# Altium project UZ_A_LTC2311.PrjPCB (part 2 of 2)

## Sheet Power_Neg.SchDoc
size A4; CompanyName: Technische Hochschule Nürnberg Georg Simon Ohm; Organization: UltraZohm; Address1: Kesslerplatz 12; Address2: 90489 Nürnberg; Address3: GERMANY; Website: www.ultrazohm.com
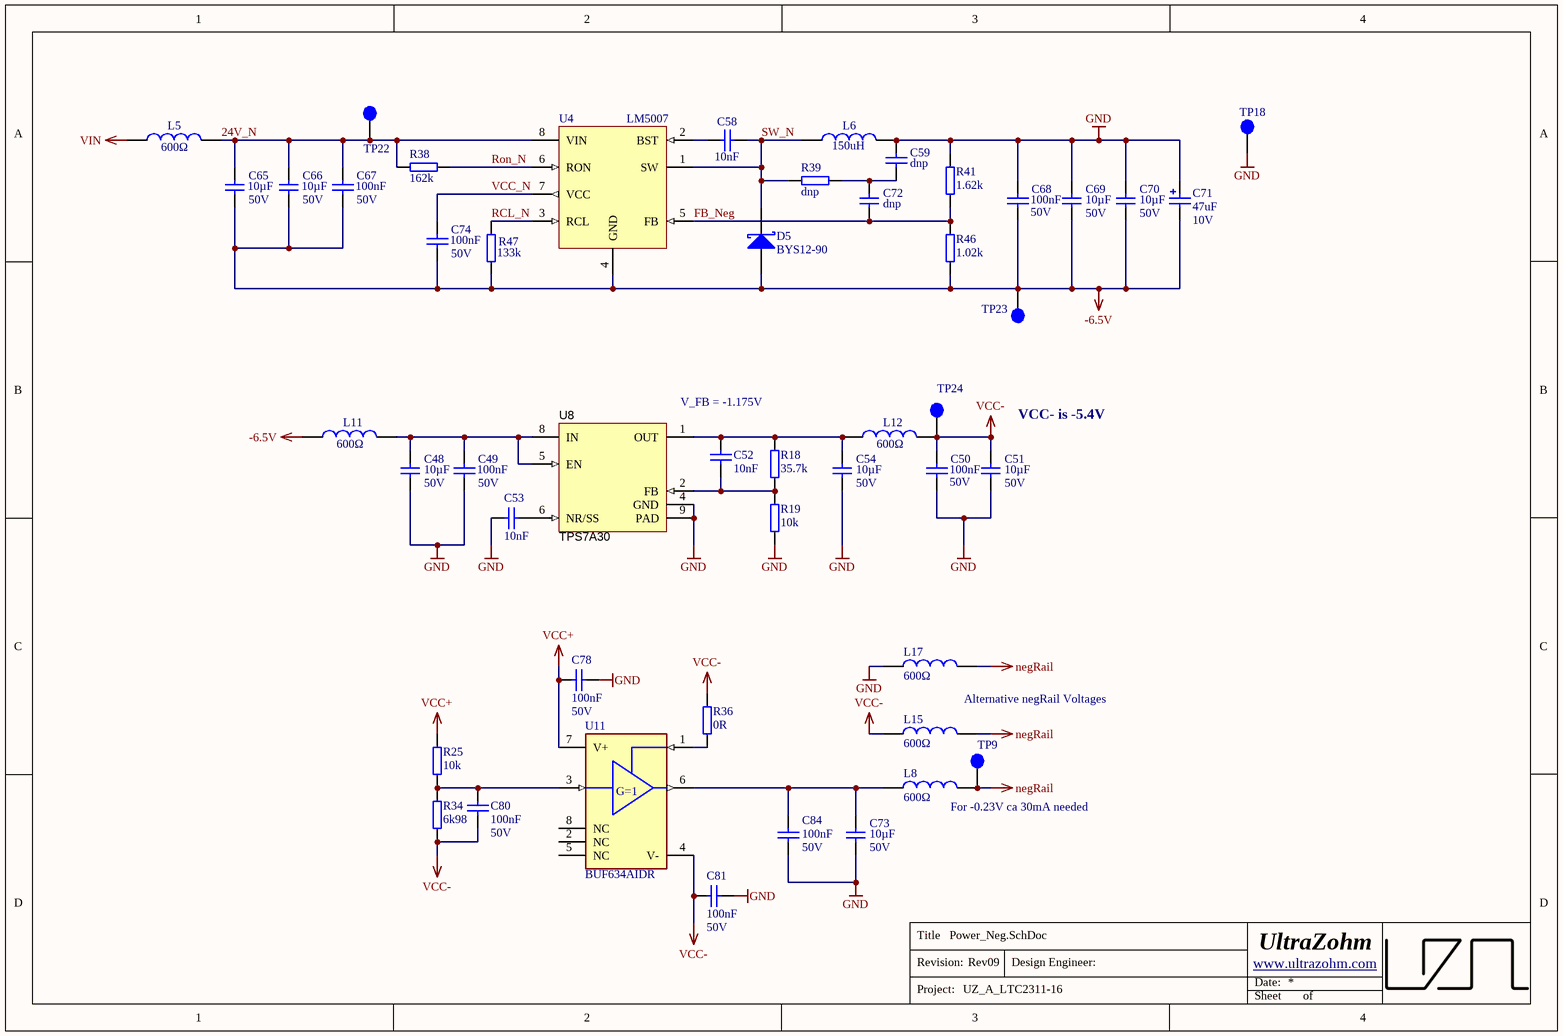
[diagram p6: Power_Neg.SchDoc]

### Parts
C48  10µF  Voltage: 50V  [C_1206]
C49  100nF  Voltage: 50V  [CAPC1608X07N]
C50  100nF  Voltage: 50V  [CAPC1608X07N]
C51  10µF  Voltage: 50V  [C_1206]
C52  10nF  [CAPC1608X07N]
C53  10nF  [CAPC1608X07N]
C54  10µF  Voltage: 50V  [C_1206]
C58  10nF  [CAPC1608X07N]
C59  dnp  [CAPC1608X07N]
C65  10µF  Voltage: 50V  [C_1206]
C66  10µF  Voltage: 50V  [C_1206]
C67  100nF  Voltage: 50V  [CAPC1608X07N]
C68  100nF  Voltage: 50V  [CAPC1608X07N]
C69  10µF  Voltage: 50V  [C_1206]
C70  10µF  Voltage: 50V  [C_1206]
C71  47uF  Voltage: 10V  [WCAP-ASLI_5x5.5]
C72  dnp  [C_1206]
C73  10µF  Voltage: 50V  [C_1206]
C74  100nF  Voltage: 50V  [CAPC1608X07N]
C78  100nF  Voltage: 50V  [CAPC1608X07N]
C80  100nF  Voltage: 50V  [CAPC1608X07N]
C81  100nF  Voltage: 50V  [CAPC1608X07N]
C84  100nF  Voltage: 50V  [CAPC1608X07N]
D5  BYS12-90  [DIOM4227X23N]
L5  600Ω  [WE-CBF_0805_High Current]
L6  150uH  [SMT_inductor_1050_Performance]
L8  600Ω  [WE-CBF_0805_High Current]
L11  600Ω  [WE-CBF_0805_High Current]
L12  600Ω  [WE-CBF_0805_High Current]
L15  600Ω  [WE-CBF_0805_High Current]
L17  600Ω  [WE-CBF_0805_High Current]
R18  35.7k  [RESC1608X06N]
R19  10k  [RESC1608X06N]
R25  10k  [RESC1608X06N]
R34  6k98  [RESC1608X06N]
R36  0R  [RESC1608X06N]
R38  162k  [RESC1608X06N]
R39  dnp  [RESC1608X06N]
R41  1.62k  [RESC1608X06N]
R46  1.02k  [RESC1608X06N]
R47  133k  [RESC1608X06N]
TP9  negRail  [TP_1mm]  (value not drawn)  (no BOM)
TP18  GND  [TP_1mm]  (value not drawn)  (no BOM)
TP22  VIN  [TP_1mm]  (value not drawn)  (no BOM)
TP23  -6.5V  [TP_1mm]  (value not drawn)  (no BOM)
TP24  VCC-  [TP_1mm]  (value not drawn)  (no BOM)
U4  LM5007  [TSOP65P490X110-8N]
U8  TPS7A30  [DGN0008D_N]
U11  BUF634AIDR  [FP-BUF634AIDR-MFG]

### Nets
-6.5V: C65.1 C66.1 C67.2 C68.1 C69.1 C70.1 C71.1(N) C74.2 D5.2(A) L11.1 R46.2 R47.1 TP23.1 U4.4(GND)
GND: C48.1 C49.2 C50.1 C51.1 C53.2 C54.1 C59.1 C68.2 C69.2 C70.2 C71.2(P) C73.1 C78.1 C81.1 C84.1 L6.2 L17.1 R19.2 R41.1 TP18.1 U8.4(GND) U8.9(PAD)
negRail: L8.2 L15.2 L17.2 TP9.1
VCC+: C78.2 R25.2 U11.7(V+)
VCC-: C50.2 C51.2 C80.2 C81.2 L12.2 L15.1 R34.1 R36.2 TP24.1 U11.4(V-)
VIN: L5.1
24V_N: C65.2 C66.2 C67.1 L5.2 R38.2 TP22.1 U4.8(VIN)
FB_Neg: C72.2 R41.2 R46.1 U4.5(FB)
RCL_N: R47.2 U4.3(RCL)
Ron_N: R38.1 U4.6(RON)
SW_N: C58.1 D5.1(K) L6.1 R39.2 U4.1(SW)
VCC_N: C74.1 U4.7(VCC)
NetC48_2: C48.2 C49.1 L11.2 U8.5(EN) U8.8(IN)
NetC52_1: C52.1 C54.2 L12.1 R18.1 U8.1(OUT)
NetC52_2: C52.2 R18.2 R19.1 U8.2(FB)
NetC53_1: C53.1 U8.6(NR/SS)
NetC58_2: C58.2 U4.2(BST)
NetC59_2: C59.2 C72.1 R39.1
NetC73_2: C73.2 C84.2 L8.1 U11.6(VO)
NetC80_1: C80.1 R25.1 R34.2 U11.3(VIN)
NetR36_1: R36.1 U11.1(BW)

Not connected (* = marked no-connect by the designer): U8 3(NC) 7(DNC); U11 2(NC) 5(NC) 8(NC)

### Notes on the sheet
- V_FB = -1.175V
- (near C51) VCC- is -5.4V
- Alternative negRail Voltages
- (near L8) For -0.23V ca 30mA needed
- Title
- Revision:
- Design Engineer:
- Date:
- Project:
- Sheet
- of
- (in symbol BUF634A) G=1

### Library data of the parts
C48 C51 C54 C69 C70 C73 = C_1206: Capacitor 1206; MPN: CL31A106MBHNNNE; Tolerance: 10%; MF: Samsung; Dielectric: X5R; Package: 1206; Value: 10µF; Created: 2020_09_17_Liegmann; Supplier 1: Mouser; Supplier Part Number 1: 187-CL31A106MBHNNNE
C49 C50 C67 C68 C74 = Cap_0603: MPN: CC0603KRX7R9BB104; MF: Yageo; Tolerance: 10%; Dielectric: X5R; Value: 100nF; Supplier 1: Mouser; Supplier 2: Mouser; Supplier Part Number 1: 603-CC603KRX7R9BB104; Supplier Part Number 2: 710-885382206004; Package: 0603
C52 C53 C58 = Cap_0603: MPN: 885012206065; MF: Würth Elektronik; Voltage: 25V; Dielectric: X7R; Value: 10nF; Supplier 1: Mouser; Supplier 2: Digi-Key; Supplier Part Number 1: 710-885012206065; Supplier Part Number 2: 732-7983-1-ND; Package: 0603
C59 = Cap_0603: MPN: C0603C752J3GACTU; possibleValue: 7.5nF; MF: KEMET; Voltage: 25V; Dielectric: C0G; Tolerance: 5%; Supplier 1: Mouser; Supplier 2: *; Supplier Part Number 1: 80-C0603C752J3GACTU; Supplier Part Number 2: *; Package: 0603; Value: dnp
C65 C66 = C_1206: Capacitor 1206; MPN: CL31A106MBHNNNE; Tolerance: 20%; MF: Samsung; Dielectric: X5R; Package: 1206; Value: 10µF; Supplier 1: Mouser; Supplier Part Number 1: 187-CL31A106MBHNNNE
C71 = 865080142007: WCAP-ASLI Aluminum Electrolytic Capacitor, V-Chip, SMT, D5xH5.5mm, 47uF, 10V; MPN: 865080242004; Dissipation Factor: 24%; Endurance: 2000h; Leakage Current: 6.3uA; MF: Wurth Elektronik; Ripple Current: 170mA; Capacitance Tolerance: +/-20%; Technical Reference: ASEC055101M6R3DVCTBB000; ComponentLink1Description: Manufacturer; ComponentLink1URL: http://www.we-online.de; ComponentLink2Description: Datasheet; ComponentLink2URL: https://www.we-online.com/catalog/datasheet/865080142007.pdf; Height: 5.5mm; Mounting Technology: SMT; Operating Temperature: -55 to +105degC; Packaging: Tape and Reel; Published Date: May 2020; Diameter: 5mm; Supplier 1: Mouser; Supplier Part Number 1: 710-865080242004; Value: 47uF
C72 = C_1206: Capacitor 1206; MPN: GRM3195C1H273JA01D; possibleValue: 0.027µF; Tolerance: 5%; MF: Murata Electronics; Dielectric: C0G; Voltage: 50V; Package: 1206; Supplier 1: Mouser; Supplier Part Number 1: 81-GRM315C1H273JA01D; Value: dnp
C78 C80 C81 C84 = Cap_0603: MPN: CC0603KRX7R9BB104; MF: Yageo; Dielectric: X5R; Value: 100nF; Supplier 1: Mouser; Supplier 2: Mouser; Supplier Part Number 1: 603-CC603KRX7R9BB104; Supplier Part Number 2: 710-885382206004; Package: 0603
D5 = BYS12-90: Schottky Diode; MPN: BYS12-90-E3/TR3; MF: Vishay; Forward Voltage: 750mV; Reverse Voltage: 90V; Rated Current: 1.5A; Package: DO-214AC; Supplier 1: Farnell; Supplier 2: Mouser; Supplier 3: Digi-Key; Supplier Part Number 1: 2889144; Supplier Part Number 2: 625-BYS12-90-E3/TR3; Supplier Part Number 3: BYS12-90-E3/GICT-ND; ComponentLink1Description: Manufacturer; ComponentLink1URL: https://www.vishay.com/; ComponentLink2Description: Datasheet; ComponentLink2URL: https://www.vishay.com/docs/88950/bys12-90.pdf
L5 L11 L12 = WE-CBF, 742792040: WE-CBF SMD EMI Suppression Ferrite Bead, 0805, 600Ω; MF: Würth Elektronik; Type: High Current; ComponentLink1Description: Manufacturer; ComponentLink1URL: http://www.we-online.de; ComponentLink2Description: Datasheet; ComponentLink2URL: http://katalog.we-online.de/pbs/datasheet/742792040.pdf; MPN: 742792040; Value: 600Ω; Size: 0805; Supplier 1: Farnell; Supplier 2: Mouser; Supplier 3: Digi-Key; Supplier Part Number 1: 1635735; Supplier Part Number 2: 710-742792040; Supplier Part Number 3: 732-1620-1-ND
L6 = B82464G4154M: SMT power Inductor, 150uH, 320m DRC; MF: EPCOS / TDK; Rated Current: 0.85 A; MPN: B82464G4154M; Supplier 1: Mouser; Supplier Part Number 1: 871-B82464G4154M; Value: 150uH; DCR: 320m; ComponentLink1Description: Manufacturer; ComponentLink1URL: https://www.tdk-electronics.tdk.com/de; ComponentLink2Description: Datasheet; ComponentLink2URL: https://www.tdk-electronics.tdk.com/inf/30/db/ind_2008/b82464g4.pdf
L8 L15 L17 = WE-CBF, 742792040: WE-CBF SMD EMI Suppression Ferrite Bead, 0805, 600Ω; MF: Wurth Elektronik; Type: High Current; PublishedDate: Aug 2016; ComponentLink1Description: Manufacturer; ComponentLink1URL: http://www.we-online.de; ComponentLink2Description: Datasheet; ComponentLink2URL: http://katalog.we-online.de/pbs/datasheet/742792040.pdf; MPN: 742792040; Value: 600Ω; Size: 0805; Supplier 1: Farnell; Supplier 2: Mouser; Supplier 3: Digi-Key; Supplier Part Number 1: 2761567; Supplier Part Number 2: 710-742792040; Supplier Part Number 3: 732-1620-1-ND
R18 = R_0603: MPN: CR0603-FX-3572ELF; MF: Bourns; Tolerance: 1%; Value: 35.7k; Supplier 1: Mouser; Supplier Part Number 1: 652-CR0603FX-3572ELF; Package: 0603
R19 R25 = R_0603: MPN: CR0603-FX-1002ELF; MF: Bourns; Tolerance: 1%; Value: 10k; Supplier 1: Mouser; Supplier Part Number 1: 652-CR0603FX-1002ELF; Package: 0603
R34 = R_0603: MPN: CR0603-FX-6981ELF; MF: Bourns; Tolerance: 1%; Value: 6k98; Supplier 1: Mouser; Supplier Part Number 1: 652-CR0603FX-6981ELF; Package: 0603
R36 = R_0603: MPN: CRCW06030000Z0EBC; MF: Vishay / Dale; Value: 0R; Supplier 1: Mouser; Supplier Part Number 1: 71-CRCW06030000Z0EBC; Package: 0603
R38 = R_0603: MPN: CR0603-FX-1623ELF; MF: Bourns; Value: 162k; Supplier 1: Mouser; Supplier Part Number 1: 652-CR0603-FX1623ELF; Package: 0603
R39 = R_0603: MPN: AC0603FR-1375KL; possibleValue: 75k; MF: Yageo; Supplier 1: Mouser; Supplier Part Number 1: 603-AC0603FR-1375KL; Package: 0603; Value: dnp
R41 = R_0603: MPN: CR0603-FX-1621ELF; MF: Bourns; Tolerance: 1%; Value: 1.62k; Supplier 1: Mouser; Supplier Part Number 1: 652-CR0603FX-1621ELF; Package: 0603
R46 = R_0603: MPN: CR0603-FX-1021ELF; MF: Bourns; Tolerance: 1%; Value: 1.02k; Supplier 1: Mouser; Supplier Part Number 1: 652-CR0603FX-1021ELF; Package: 0603
R47 = R_0603: MPN: CR0603-FX-1333ELF; MF: Bourns; Value: 133k; Supplier 1: Mouser; Supplier Part Number 1: 652-CR0603FX-1333ELF; Package: 0603
TP9 TP18 TP22-TP24 = TP_1mm: Testpoint 1mm; Created: 2018_06_25_AGeiger; Value: Testpoint 1mm
U4 = LM5007: Buck Converter, 9-75Vin, 2.5-73Vout; MPN: LM5007MM/NOPB; MF: Texas Instruments; Supplier 1: Farnell; Supplier 2: Mouser; Supplier 3: Digi-Key; Supplier Part Number 1: 9779345; Supplier Part Number 2: 926-LM5007MM/NOPB; Supplier Part Number 3: LM5007MM/NOPBCT-ND; Package: VSSOP-8; ComponentLink1Description: Manufacturer; ComponentLink1URL: https://www.ti.com/; ComponentLink2Description: Datasheet; ComponentLink2URL: https://www.ti.com/lit/ds/symlink/lm5007.pdf?ts=1616234834930&ref_url=https%253A%252F%252Fwww.google.ru%252F
U8 = TPS7A3001DGN: -36V, -200mA, Ultralow-Noise, High PSRR, Adjustable -1.18 to -33 V Output, Negative Linear Regulator, 8-pin MSOP (DGN), -40 to 125 degC, Green (RoHS & no Sb/Br); MF: Texas Instruments; Parameter 1: Farnell; PackageReference: DGN0008D; PackageDescription: 8-pin Plastic Small Outline, Body 3 x 3 mm, Pitch 0.65 mm; Supplier 1: Digi-Key; Supplier Part Number 1: 296-27750-1-ND; MPN: TPS7A3001DGN; ComponentLink1Description: Manufacturer URL; ComponentLink1URL: http://www.ti.com/; ComponentLink2Description: Datasheet; ComponentLink2URL: http://www.ti.com/general/docs/lit/getliterature.tsp?genericPartNumber=TPS7A3001&fileType=pdf; ComponentLink3Description: Package Specification; ComponentLink3URL: http://www.ti.com/litv/pdf/mpds046e; Supplier 2: Mouser; Supplier Part Number 2: 595-TPS7A3001DGNT; Supplier Part Number 3: 3122632
U11 = BUF634A: IC OP AMP BUFFER 8SOIC; Voltage Gain: 0.00099V/mV; Standoff Height: 0.11mm; Min Dual Supply Voltage: 2.25V; Gain Bandwidth: 240MHz; Output Current Per Channel: 250mA; Input Offset Voltage: 36mV; Min Supply Voltage: 4.5V; Number Of Channels: 1; Max Junction Temp: +150°C; Max Supply Voltage: 36V; Bandwidth: 35-210MHz; Input Bias Current: 0.03-0.25uA; Max Dual Supply Voltage: 18V; MF: Texas Instruments; Nominal Supply Current: 1.5-8.5mA; Height: 1.75mm; MPN: BUF634AIDR; Automotive: No; Digikey Description: IC OP AMP BUFFER 8SOIC; Device Class L3: Buffer; ComponentLink2URL: http://www.ti.com/lit/ds/symlink/buf634a.pdf; Category: IC; Device Class L2: Linear ICs; Device Class L1: Integrated Circuits (ICs); Temperature Range Low: -40°C; Package: SOIC8; Temperature: -40°C to +125°C; Temperature Range High: +125°C; Mouser Description: High-Speed Buffer 1 Channel 35MHz to 210MHz 36V 250mA Bipolar 8-Pin SOIC T/R; Octopart: https://octopart.com/buf634aidr-texas+instruments-99505311; RoHS: TRUE; Lead Free: Yes; ComponentLink2Description: Datasheet; Supplier 1: Mouser; Supplier Part Number 1: 595-BUF634AIDR

## Sheet ADC_Reference.SchDoc
size A4; CompanyName: Technische Hochschule Nürnberg Georg Simon Ohm; Organization: UltraZohm; Address1: Kesslerplatz 12; Address2: 90489 Nürnberg; Address3: GERMANY; Website: www.ultrazohm.com
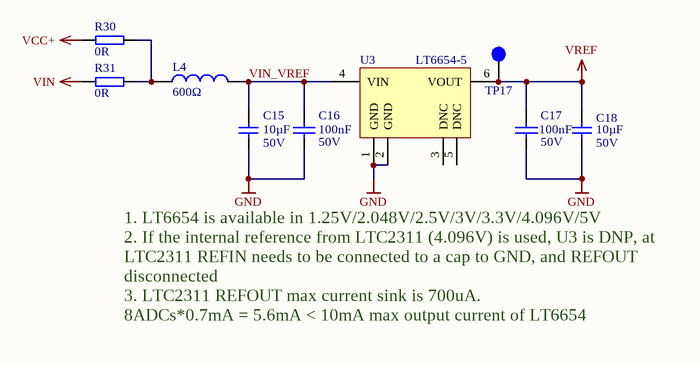
[diagram p7: ADC_Reference.SchDoc]

### Parts
C15  10µF  Voltage: 50V  [C_1206]
C16  100nF  Voltage: 50V  [CAPC1608X07N]
C17  100nF  Voltage: 50V  [CAPC1608X07N]
C18  10µF  Voltage: 50V  [C_1206]
L4  600Ω  [WE-CBF_0805_High Current]
R30  0R  [RESC1608X06N]
R31  0R  [RESC1608X06N]
TP17  VREF  [TP_1mm]  (value not drawn)  (no BOM)
U3  LT6654-5  [SOT95P280X100-6N]

### Nets
GND: C15.1 C16.2 C17.2 C18.1 U3.1(GND) U3.2(GND)
VCC+: R30.1
VIN: R31.1
VREF: C17.1 C18.2 TP17.1 U3.6(VOUT)
VIN_VREF: C15.2 C16.1 L4.2 U3.4(VIN)
NetL4_1: L4.1 R30.2 R31.2

Not connected (* = marked no-connect by the designer): U3 3(DNC) 5(DNC)

### Notes on the sheet
- 1. LT6654 is available in 1.25V/2.048V/2.5V/3V/3.3V/4.096V/5V
  2. If the internal reference from LTC2311 (4.096V) is used, U3 is DNP, at LTC2311 REFIN needs to be connected to a cap to GND, and REFOUT disconnected
  3. LTC2311 REFOUT max current sink is 700uA.
  8ADCs*0.7mA = 5.6mA < 10mA max output current of LT6654
- Title
- Revision:
- Design Engineer:
- Date:
- Project:
- Sheet
- of

### Library data of the parts
C15 = C_1206: as C65 on sheet Power_Neg; Package: 1206; Value: 10µF; Supplier 1: Mouser; Supplier Part Number 1: 187-CL31A106MBHNNNE
C16 C17 = Cap_0603: as C78 on sheet Power_Neg; Value: 100nF; Supplier 1: Mouser; Supplier 2: Mouser; Supplier Part Number 1: 603-CC603KRX7R9BB104; Supplier Part Number 2: 710-885382206004; Package: 0603
C18 = C_1206: as C48 on sheet Power_Neg; Package: 1206; Value: 10µF; Created: 2020_09_17_Liegmann; Supplier 1: Mouser; Supplier Part Number 1: 187-CL31A106MBHNNNE
L4 = WE-CBF, 742792040: as L8 on sheet Power_Neg; PublishedDate: Aug 2016; ComponentLink1Description: Manufacturer; ComponentLink1URL: http://www.we-online.de; ComponentLink2Description: Datasheet; ComponentLink2URL: http://katalog.we-online.de/pbs/datasheet/742792040.pdf; MPN: 742792040; Value: 600Ω; Size: 0805; Supplier 1: Farnell; Supplier 2: Mouser; Supplier 3: Digi-Key; Supplier Part Number 1: 2761567; Supplier Part Number 2: 710-742792040; Supplier Part Number 3: 732-1620-1-ND
R30 R31 = R_0603: as R36 on sheet Power_Neg; Value: 0R; Supplier 1: Mouser; Supplier Part Number 1: 71-CRCW06030000Z0EBC; Package: 0603
TP17 = TP_1mm: Testpoint 1mm; Created: 2018_06_25_AGeiger; Value: Testpoint 1mm
U3 = LT6654: MPN: LT6654AIS6-5#TRMPBF; MF: Analog Devices; Package: TSOT-23-6; Supplier 1: Farnell; Supplier 2: Mouser; Supplier 3: Digi-Key; Supplier Part Number 1: 2761960; Supplier Part Number 2: 584-6654AIS65TRMPBF; Supplier Part Number 3: LT6654AIS6-5#TRMPBFCT-ND; ComponentLink1Description: Manufacturer; ComponentLink1URL: https://www.analog.com/en/index.html; ComponentLink2Description: Datasheet; ComponentLink2URL: https://www.analog.com/media/en/technical-documentation/data-sheets/6654fh.pdf

## Nets that join several sheets
5V_ext: Power_Pos (C24.1 TP11.1 U10.5), AnalogConnector (14 pins)
+1.8V: Power_Pos (C89.1 C90.2 TP10.1 U14.5), CarrierConnector (10 pins)
+2.5V: Power_Pos (5 pins), AnalogConnector (R28.2), ADC1 (C29A.1 U6A.10 U6A.12), ADC2 (C29B.1 U6B.10 U6B.12), ADC3 (C29C.1 U6C.10 U6C.12), ADC4 (C29D.1 U6D.10 U6D.12), ADC5 (C29E.1 U6E.10 U6E.12), ADC6 (C29F.1 U6F.10 U6F.12), ADC7 (C29G.1 U6G.10 U6G.12), ADC8 (C29H.1 U6H.10 U6H.12)
GND: Power_Pos (41 pins), CarrierConnector (42 pins), AnalogConnector (20 pins), ADC1 (13 pins), ADC2 (13 pins), ADC3 (13 pins), ADC4 (13 pins), ADC5 (13 pins), ADC6 (13 pins), ADC7 (13 pins), ADC8 (13 pins), OpAmp1 (11 pins), OpAmp2 (11 pins), OpAmp3 (11 pins), OpAmp4 (11 pins), OpAmp5 (11 pins), OpAmp6 (11 pins), OpAmp7 (11 pins), OpAmp8 (11 pins), Power_Neg (22 pins), ADC_Reference (6 pins)
negRail: OpAmp1 (C44A.2 U15A.6), OpAmp2 (C44B.2 U15B.6), OpAmp3 (C44C.2 U15C.6), OpAmp4 (C44D.2 U15D.6), OpAmp5 (C44E.2 U15E.6), OpAmp6 (C44F.2 U15F.6), OpAmp7 (C44G.2 U15G.6), OpAmp8 (C44H.2 U15H.6), Power_Neg (L8.2 L15.2 L17.2 TP9.1)
VCC+: Power_Pos (C61.2 C62.2 L14.2 TP12.1), CarrierConnector (R4.1), AnalogConnector (R56.2), ADC1 (C27A.1 C28A.1 U6A.4), ADC2 (C27B.1 C28B.1 U6B.4), ADC3 (C27C.1 C28C.1 U6C.4), ADC4 (C27D.1 C28D.1 U6D.4), ADC5 (C27E.1 C28E.1 U6E.4), ADC6 (C27F.1 C28F.1 U6F.4), ADC7 (C27G.1 C28G.1 U6G.4), ADC8 (C27H.1 C28H.1 U6H.4), OpAmp1 (C39A.1 C40A.1 U7A.8 U15A.3), OpAmp2 (C39B.1 C40B.1 U7B.8 U15B.3), OpAmp3 (C39C.1 C40C.1 U7C.8 U15C.3), OpAmp4 (C39D.1 C40D.1 U7D.8 U15D.3), OpAmp5 (C39E.1 C40E.1 U7E.8 U15E.3), OpAmp6 (C39F.1 C40F.1 U7F.8 U15F.3), OpAmp7 (C39G.1 C40G.1 U7G.8 U15G.3), OpAmp8 (C39H.1 C40H.1 U7H.8 U15H.3), Power_Neg (C78.2 R25.2 U11.7), ADC_Reference (R30.1)
VCC-: AnalogConnector (R73.1), OpAmp1 (C42A.2 U7A.4), OpAmp2 (C42B.2 U7B.4), OpAmp3 (C42C.2 U7C.4), OpAmp4 (C42D.2 U7D.4), OpAmp5 (C42E.2 U7E.4), OpAmp6 (C42F.2 U7F.4), OpAmp7 (C42G.2 U7G.4), OpAmp8 (C42H.2 U7H.4), Power_Neg (10 pins)
VCOM: Power_Pos (C25.1 C26.2 L7.2 TP19.1), OpAmp1 (C36A.1 U15A.2), OpAmp2 (C36B.1 U15B.2), OpAmp3 (C36C.1 U15C.2), OpAmp4 (C36D.1 U15D.2), OpAmp5 (C36E.1 U15E.2), OpAmp6 (C36F.1 U15F.2), OpAmp7 (C36G.1 U15G.2), OpAmp8 (C36H.1 U15H.2)
VIN: Power_Pos (L1.1), CarrierConnector (X1.5 X1.6), AnalogConnector (5 pins), Power_Neg (L5.1), ADC_Reference (R31.1)
VREF: ADC1 (R43A.2), ADC2 (R43B.2), ADC3 (R43C.2), ADC4 (R43D.2), ADC5 (R43E.2), ADC6 (R43F.2), ADC7 (R43G.2), ADC8 (R43H.2), ADC_Reference (C17.1 C18.2 TP17.1 U3.6)
ADC_OUT_N1: CarrierConnector (X1.43), ADC1 (U6A.13)
ADC_OUT_N2: CarrierConnector (X1.37), ADC2 (U6B.13)
ADC_OUT_N3: CarrierConnector (X1.31), ADC3 (U6C.13)
ADC_OUT_N4: CarrierConnector (X1.25), ADC4 (U6D.13)
ADC_OUT_N5: CarrierConnector (X1.44), ADC5 (U6E.13)
ADC_OUT_N6: CarrierConnector (X1.38), ADC6 (U6F.13)
ADC_OUT_N7: CarrierConnector (X1.32), ADC7 (U6G.13)
ADC_OUT_N8: CarrierConnector (X1.26), ADC8 (U6H.13)
ADC_OUT_P1: CarrierConnector (X1.41), ADC1 (U6A.14)
ADC_OUT_P2: CarrierConnector (X1.35), ADC2 (U6B.14)
ADC_OUT_P3: CarrierConnector (X1.29), ADC3 (U6C.14)
ADC_OUT_P4: CarrierConnector (X1.23), ADC4 (U6D.14)
ADC_OUT_P5: CarrierConnector (X1.42), ADC5 (U6E.14)
ADC_OUT_P6: CarrierConnector (X1.36), ADC6 (U6F.14)
ADC_OUT_P7: CarrierConnector (X1.30), ADC7 (U6G.14)
ADC_OUT_P8: CarrierConnector (X1.24), ADC8 (U6H.14)
AIN_N1: AnalogConnector (J1.A8), OpAmp1 (R66A.1)
AIN_N2: AnalogConnector (J1.A5), OpAmp2 (R66B.1)
AIN_N3: AnalogConnector (J1.A6), OpAmp3 (R66C.1)
AIN_N4: AnalogConnector (J1.A2), OpAmp4 (R66D.1)
AIN_N5: AnalogConnector (J1.B8), OpAmp5 (R66E.1)
AIN_N6: AnalogConnector (J1.B5), OpAmp6 (R66F.1)
AIN_N7: AnalogConnector (J1.B6), OpAmp7 (R66G.1)
AIN_N8: AnalogConnector (J1.B2), OpAmp8 (R66H.1)
AIN_P1: AnalogConnector (J1.A7), OpAmp1 (R65A.1)
AIN_P2: AnalogConnector (J1.A4), OpAmp2 (R65B.1)
AIN_P3: AnalogConnector (J1.A3), OpAmp3 (R65C.1)
AIN_P4: AnalogConnector (J1.A1), OpAmp4 (R65D.1)
AIN_P5: AnalogConnector (J1.B7), OpAmp5 (R65E.1)
AIN_P6: AnalogConnector (J1.B4), OpAmp6 (R65F.1)
AIN_P7: AnalogConnector (J1.B3), OpAmp7 (R65G.1)
AIN_P8: AnalogConnector (J1.B1), OpAmp8 (R65H.1)
CLK_N: CarrierConnector (R1.1 R2.1 TP1.1 X1.19), ADC1 (U6A.15), ADC2 (U6B.15), ADC3 (U6C.15), ADC4 (U6D.15), ADC5 (U6E.15), ADC6 (U6F.15), ADC7 (U6G.15), ADC8 (U6H.15)
CLK_P: CarrierConnector (R1.2 R2.2 TP2.1 X1.17), ADC1 (U6A.16), ADC2 (U6B.16), ADC3 (U6C.16), ADC4 (U6D.16), ADC5 (U6E.16), ADC6 (U6F.16), ADC7 (U6G.16), ADC8 (U6H.16)
CVN1: CarrierConnector (R33.2 R48.2), ADC1 (U6A.9)
CVN2: CarrierConnector (R37.2 R53.2), ADC2 (U6B.9)
CVN3: CarrierConnector (R40.2 R57.2), ADC3 (U6C.9)
CVN4: CarrierConnector (R42.2 R60.2), ADC4 (U6D.9)
CVN5: CarrierConnector (R61.2), ADC5 (U6E.9)
CVN6: CarrierConnector (R63.2), ADC6 (U6F.9)
CVN7: CarrierConnector (R62.2), ADC7 (U6G.9)
CVN8: CarrierConnector (R64.2), ADC8 (U6H.9)
OUT_N1: ADC1 (R13A.1), OpAmp1 (C34A.2 R17A.2 U15A.5)
OUT_N2: ADC2 (R13B.1), OpAmp2 (C34B.2 R17B.2 U15B.5)
OUT_N3: ADC3 (R13C.1), OpAmp3 (C34C.2 R17C.2 U15C.5)
OUT_N4: ADC4 (R13D.1), OpAmp4 (C34D.2 R17D.2 U15D.5)
OUT_N5: ADC5 (R13E.1), OpAmp5 (C34E.2 R17E.2 U15E.5)
OUT_N6: ADC6 (R13F.1), OpAmp6 (C34F.2 R17F.2 U15F.5)
OUT_N7: ADC7 (R13G.1), OpAmp7 (C34G.2 R17G.2 U15G.5)
OUT_N8: ADC8 (R13H.1), OpAmp8 (C34H.2 R17H.2 U15H.5)
OUT_P1: ADC1 (R12A.1), OpAmp1 (C38A.2 R29A.2 U15A.4)
OUT_P2: ADC2 (R12B.1), OpAmp2 (C38B.2 R29B.2 U15B.4)
OUT_P3: ADC3 (R12C.1), OpAmp3 (C38C.2 R29C.2 U15C.4)
OUT_P4: ADC4 (R12D.1), OpAmp4 (C38D.2 R29D.2 U15D.4)
OUT_P5: ADC5 (R12E.1), OpAmp5 (C38E.2 R29E.2 U15E.4)
OUT_P6: ADC6 (R12F.1), OpAmp6 (C38F.2 R29F.2 U15F.4)
OUT_P7: ADC7 (R12G.1), OpAmp7 (C38G.2 R29G.2 U15G.4)
OUT_P8: ADC8 (R12H.1), OpAmp8 (C38H.2 R29H.2 U15H.4)

## Assembly variants
No Buffer: not fitted C47A C47B C47C C47D C47E C47F C47G C47H C59 C72 C73 L15 L17 R3 R4 R6 R22A R22B R22C R22D R22E R22F R22G R22H R26A R26B R26C R26D R26E R26F R26G R26H R27A R27B R27C R27D R27E R27F R27G R27H R30 R36 R39 U7A U7B
Current Signal: not fitted C47A C47B C47C C47D C47E C47F C47G C47H C59 C72 C73 L15 L17 R3 R4 R6 R15A R15B R15C R15D R15E R15F R15G R15H R16A R16B R16C R16D R16E R16F R16G R16H R26A R26B R26C R26D R26E R26F R26G R26H R27A R27B R27C R27D R27E R27F R27G R27H R30 R36 R39
Standard: not fitted C47A C47B C47C C47D C47E C47F C47G C47H C59 C72 C73 L15 L17 R3 R4 R6 R15A R15B R15C R15D R15E R15F R15G R15H R16A R16B R16C R16D R16E R16F R16G R16H R22A R22B R22C R22D R22E R22F R22G R22H R26A R26B R26C R26D R26E R26F R26G R26H R27A R27B R27C R27D R27E R27F R27G R27H R30 R33 R36 R37 R39 R40 R42 U12